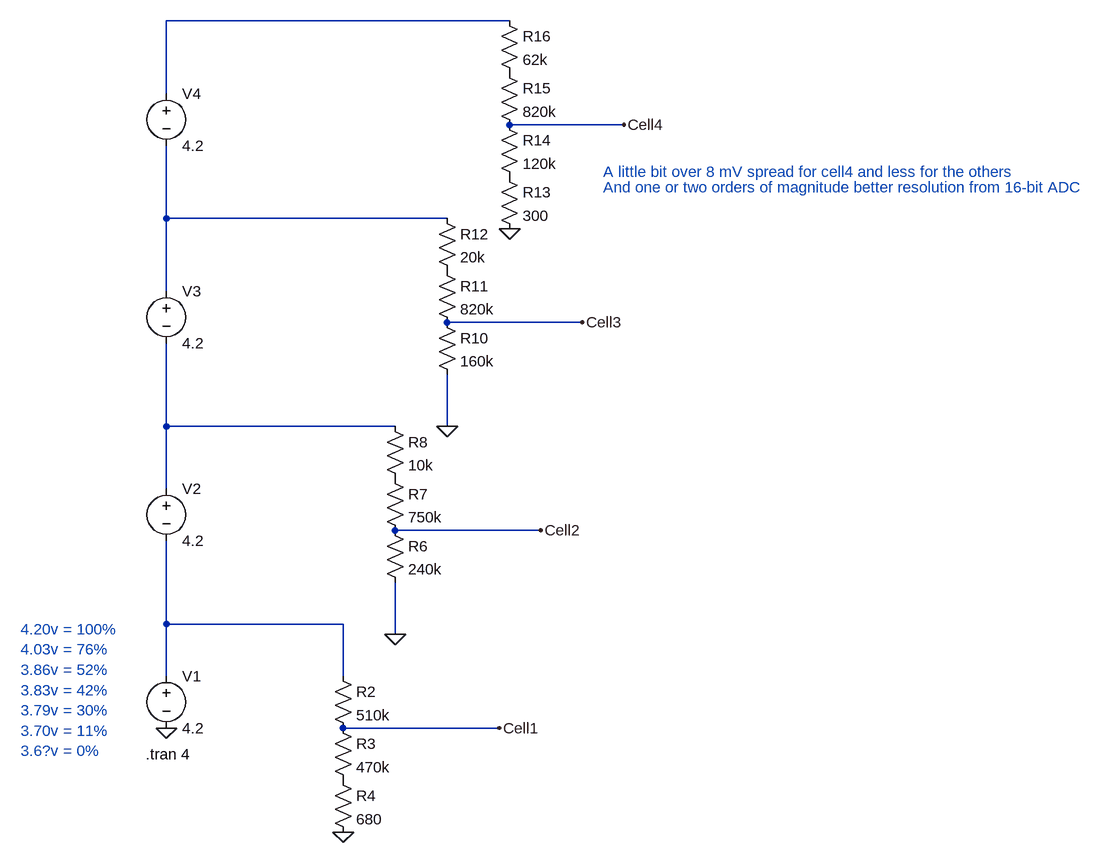
[diagram p0: schematic BatteryMonitorSingleEndedDivider.asc]
BatteryMonitorSingleEndedDivider.asc, the LTspice schematic file:
Version 4
SHEET 1 1600 680
WIRE 544 -800 16 -800
WIRE 16 -688 16 -800
WIRE 720 -640 544 -640
WIRE 16 -496 16 -608
WIRE 448 -496 16 -496
WIRE 16 -384 16 -496
WIRE 656 -336 448 -336
WIRE 16 -176 16 -304
WIRE 368 -176 16 -176
WIRE 448 -176 448 -256
WIRE 16 -80 16 -176
WIRE 592 -16 368 -16
WIRE 16 128 16 0
WIRE 288 128 16 128
WIRE 368 144 368 64
WIRE 16 208 16 128
WIRE 288 208 288 128
WIRE 528 288 288 288
FLAG 528 288 Cell1
FLAG 592 -16 Cell2
FLAG 656 -336 Cell3
FLAG 720 -640 Cell4
FLAG 544 -480 0
FLAG 448 -176 0
FLAG 368 144 0
FLAG 288 448 0
FLAG 16 288 0
SYMBOL voltage 16 192 R0
WINDOW 123 0 0 Left 2
WINDOW 39 0 0 Left 2
SYMATTR InstName V1
SYMATTR Value 4.2
SYMBOL voltage 16 -96 R0
WINDOW 123 0 0 Left 2
WINDOW 39 0 0 Left 2
SYMATTR InstName V2
SYMATTR Value 4.2
SYMBOL voltage 16 -400 R0
WINDOW 123 0 0 Left 2
WINDOW 39 0 0 Left 2
SYMATTR InstName V3
SYMATTR Value 4.2
SYMBOL voltage 16 -704 R0
WINDOW 123 0 0 Left 2
WINDOW 39 0 0 Left 2
SYMATTR InstName V4
SYMATTR Value 4.2
SYMBOL res 272 192 R0
SYMATTR InstName R2
SYMATTR Value 510k
SYMBOL res 272 272 R0
SYMATTR InstName R3
SYMATTR Value 470k
SYMBOL res 272 352 R0
SYMATTR InstName R4
SYMATTR Value 680
SYMBOL res 352 -32 R0
SYMATTR InstName R6
SYMATTR Value 240k
SYMBOL res 352 -112 R0
SYMATTR InstName R7
SYMATTR Value 750k
SYMBOL res 352 -192 R0
SYMATTR InstName R8
SYMATTR Value 10k
SYMBOL res 432 -352 R0
SYMATTR InstName R10
SYMATTR Value 160k
SYMBOL res 432 -432 R0
SYMATTR InstName R11
SYMATTR Value 820k
SYMBOL res 432 -512 R0
SYMATTR InstName R12
SYMATTR Value 20k
SYMBOL res 528 -576 R0
SYMATTR InstName R13
SYMATTR Value 300
SYMBOL res 528 -656 R0
SYMATTR InstName R14
SYMATTR Value 120k
SYMBOL res 528 -736 R0
SYMATTR InstName R15
SYMATTR Value 820k
SYMBOL res 528 -816 R0
SYMATTR InstName R16
SYMATTR Value 62k
TEXT -16 328 Left 2 !.tran 4
TEXT -208 136 Left 2 ;4.20v = 100%\n4.03v = 76%\n3.86v = 52%\n3.83v = 42%\n3.79v = 30%\n3.70v = 11%\n3.6?v = 0%
TEXT 688 -568 Left 2 ;A little bit over 8 mV spread for cell4 and less for the others
TEXT 688 -544 Left 2 ;And one or two orders of magnitude better resolution from 16-bit ADC

The netlist it stands for:
* BatteryMonitorSingleEndedDivider.asc
V1 N004 0 4.2
V2 N003 N004 4.2
V3 N002 N003 4.2
V4 N001 N002 4.2
R2 N004 Cell1 510k
R3 Cell1 P001 470k
R4 P001 0 680
R6 Cell2 0 240k
R7 P002 Cell2 750k
R8 N003 P002 10k
R10 Cell3 0 160k
R11 P003 Cell3 820k
R12 N002 P003 20k
R13 P004 0 300
R14 Cell4 P004 120k
R15 P005 Cell4 820k
R16 N001 P005 62k
.tran 4
* 4.20v = 100%
* 4.03v = 76%
* 3.86v = 52%
* 3.83v = 42%
* 3.79v = 30%
* 3.70v = 11%
* 3.6?v = 0%
* A little bit over 8 mV spread for cell4 and less for the others
* And one or two orders of magnitude better resolution from 16-bit ADC
.backanno
.end